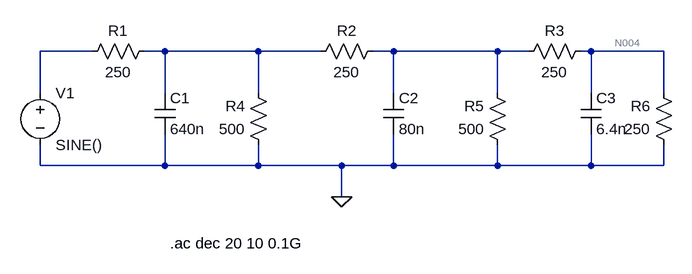
[diagram p0: schematic Part1(A).asc]
Part1(A).asc, the LTspice schematic file:
Version 4
SHEET 1 1012 680
WIRE 112 256 32 256
WIRE 224 256 192 256
WIRE 368 256 224 256
WIRE 464 256 368 256
WIRE 576 256 544 256
WIRE 736 256 576 256
WIRE 784 256 736 256
WIRE 880 256 864 256
WIRE 992 256 880 256
WIRE 32 320 32 256
WIRE 224 320 224 256
WIRE 368 320 368 256
WIRE 576 320 576 256
WIRE 736 320 736 256
WIRE 880 320 880 256
WIRE 992 320 992 256
WIRE 32 432 32 400
WIRE 224 432 224 384
WIRE 224 432 32 432
WIRE 368 432 368 400
WIRE 368 432 224 432
WIRE 496 432 368 432
WIRE 576 432 576 384
WIRE 576 432 496 432
WIRE 736 432 736 400
WIRE 736 432 576 432
WIRE 880 432 880 384
WIRE 880 432 736 432
WIRE 992 432 992 400
WIRE 992 432 880 432
WIRE 496 480 496 432
FLAG 496 480 0
SYMBOL res 208 240 R90
WINDOW 0 0 56 VBottom 2
WINDOW 3 32 56 VTop 2
SYMATTR InstName R1
SYMATTR Value 250
SYMBOL res 560 240 R90
WINDOW 0 0 56 VBottom 2
WINDOW 3 32 56 VTop 2
SYMATTR InstName R2
SYMATTR Value 250
SYMBOL res 880 240 R90
WINDOW 0 0 56 VBottom 2
WINDOW 3 32 56 VTop 2
SYMATTR InstName R3
SYMATTR Value 250
SYMBOL res 384 416 R180
WINDOW 0 36 76 Left 2
WINDOW 3 36 40 Left 2
SYMATTR InstName R4
SYMATTR Value 500
SYMBOL res 752 416 R180
WINDOW 0 36 76 Left 2
WINDOW 3 36 40 Left 2
SYMATTR InstName R5
SYMATTR Value 500
SYMBOL res 1008 416 R180
WINDOW 0 36 76 Left 2
WINDOW 3 36 40 Left 2
SYMATTR InstName R6
SYMATTR Value 250
SYMBOL cap 208 320 R0
SYMATTR InstName C1
SYMATTR Value 640n
SYMBOL cap 560 320 R0
SYMATTR InstName C2
SYMATTR Value 80n
SYMBOL cap 864 320 R0
SYMATTR InstName C3
SYMATTR Value 6.4n
SYMBOL voltage 32 304 R0
SYMATTR InstName V1
SYMATTR Value SINE()
SYMATTR Value2 AC 1
TEXT 232 552 Left 2 !.ac dec 20 10 0.1G

The netlist it stands for:
* Part1(A).asc
R1 N002 N001 250
R2 N003 N002 250
R3 N004 N003 250
R4 0 N002 500
R5 0 N003 500
R6 0 N004 250
C1 N002 0 640n
C2 N003 0 80n
C3 N004 0 6.4n
V1 N001 0 SINE() AC 1
.ac dec 20 10 0.1G
.backanno
.end

* Results of the author's LTspice run, read from the files saved beside the schematic
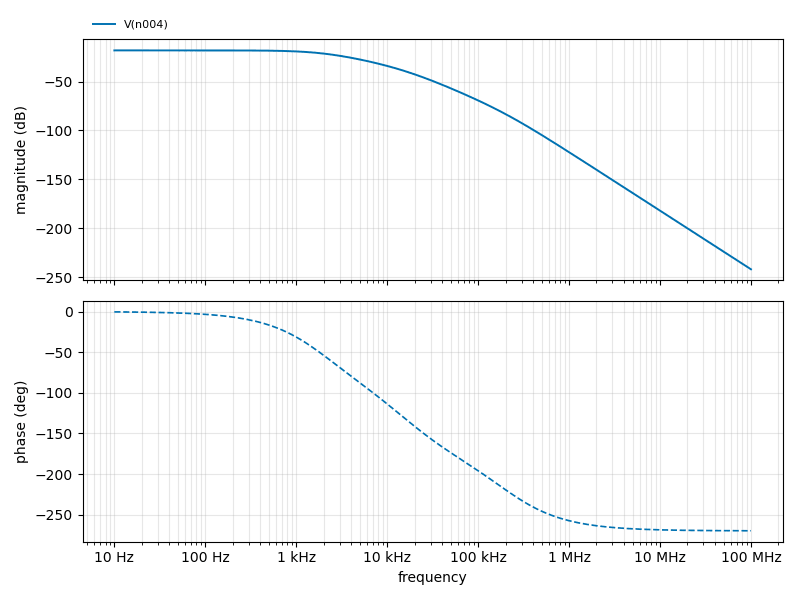
[diagram p1: AC Analysis of Part1(A).asc, plotted from the saved traces]
* AC Analysis, 1 run:
*   V(n004): -18.06 dB at 10 Hz, -242.08 dB at 100 MHz, peak -18.06 dB at 10 Hz, 3 dB below the peak at 1.89 kHz